# EAGLE schematic Simple_MCU_V01 (EAGLE 7.5.0)

## Sheet 1 of 2
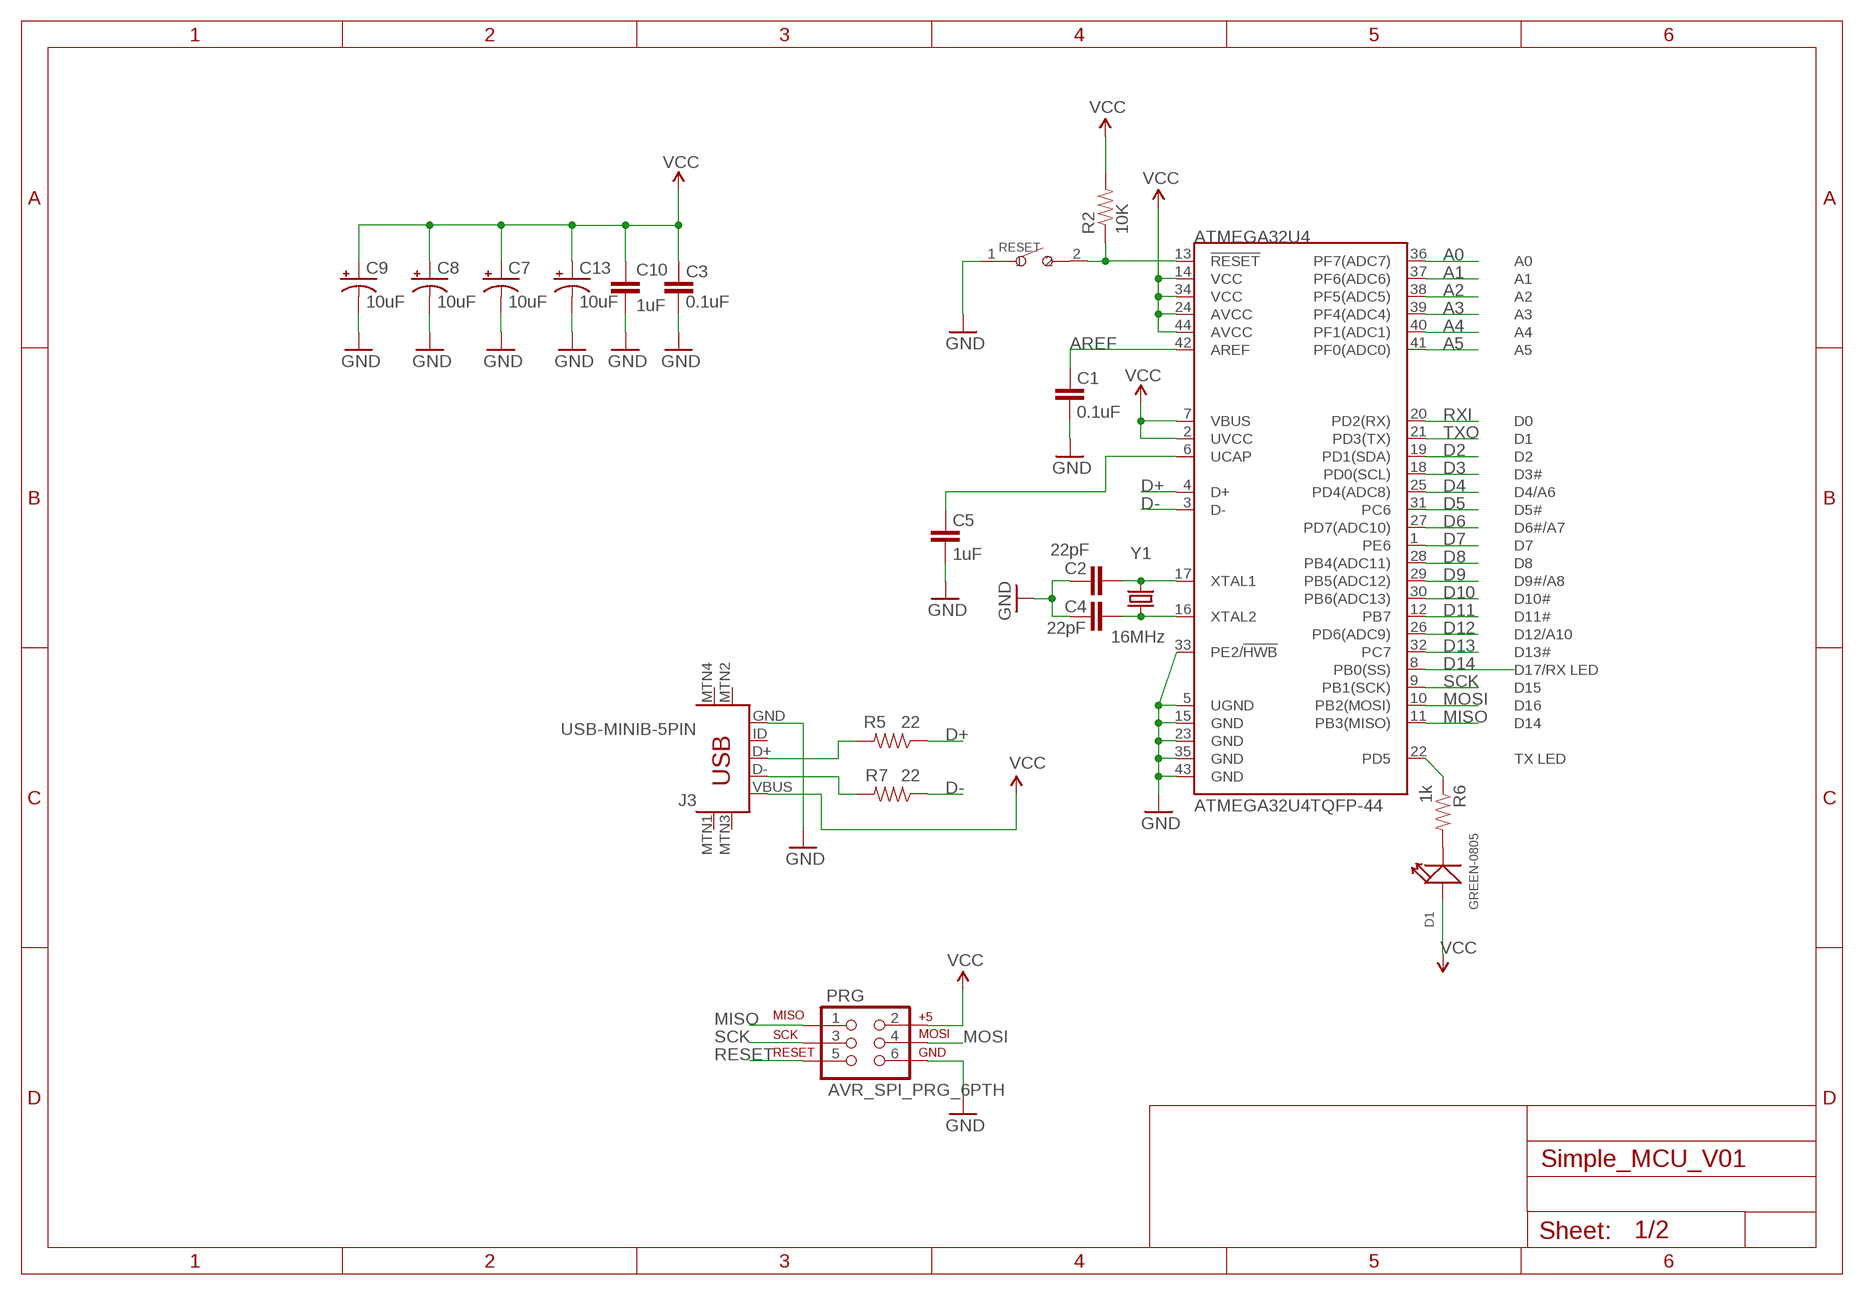
[diagram p0: schematic, sheet 1]

### Parts
ATMEGA32U4  ATMEGA32U4TQFP-44  [TQFP44]
C1  0.1uF  CAP0805  [0805]
C2  22pF  CAP0805  [0805]
C3  0.1uF  CAP0805  [0805]
C4  22pF  CAP0805  [0805]
C5  1uF  CAP0805  [0805]
C7  10uF  CAP_POL1206  [EIA3216]
C8  10uF  CAP_POL1206  [EIA3216]
C9  10uF  CAP_POL1206  [EIA3216]
C10  1uF  CAP0805  [0805]
C13  10uF  CAP_POL1206  [EIA3216]
D1  GREEN-0805  SMD-LED-CLEAR-GREEN(0805)  [LED-0805]
J3  USB-MINIB-5PIN  [USB-MINIB]
PRG  AVR_SPI_PRG_6PTH  [2X3]
R2  10K  RESISTOR0805-RES  [0805]
R5  22  RESISTOR0805-RES  [0805]
R6  1k  RESISTOR0805-RES  [0805]
R7  22  RESISTOR0805-RES  [0805]
RESET  B3U-1000P-2P-SMD  SMD-BUTTON(2P-4.0X3.0X1.5+0.5MM)SW-TS-017A-2P  [SW2-4.0X3.0X2.0]
Y1  16MHz  CRYSTALHC49US  [HC49US]

### Nets
3.3V [vcc]: ATMEGA32U4.2(UVCC) ATMEGA32U4.7(VBUS) ATMEGA32U4.14(VCC) ATMEGA32U4.24(AVCC) ATMEGA32U4.34(VCC) ATMEGA32U4.44(AVCC) C3.2 C7.A(+) C8.A(+) C9.A(+) C10.1 C13.A(+) D1.+ J3.VBUS PRG.2 R2.2 ; supply symbol labelled VCC ; also sheet 2
A0: ATMEGA32U4.36(PF7(ADC7))
A1: ATMEGA32U4.37(PF6(ADC6))
A2: ATMEGA32U4.38(PF5(ADC5))
A3: ATMEGA32U4.39(PF4(ADC4))
A4: ATMEGA32U4.40(PF1(ADC1))
A5: ATMEGA32U4.41(PF0(ADC0))
AREF: ATMEGA32U4.42(AREF) C1.2
D2: ATMEGA32U4.19(PD1(SDA))
D3: ATMEGA32U4.18(PD0(SCL))
D4: ATMEGA32U4.25(PD4(ADC8))
D5: ATMEGA32U4.31(PC6) ; also sheet 2
D6: ATMEGA32U4.27(PD7(ADC10))
D7: ATMEGA32U4.1(PE6)
D8: ATMEGA32U4.28(PB4(ADC11))
D9: ATMEGA32U4.29(PB5(ADC12))
D10: ATMEGA32U4.30(PB6(ADC13))
D11: ATMEGA32U4.12(PB7)
D12: ATMEGA32U4.26(PD6(ADC9))
D13: ATMEGA32U4.32(PC7)
D14: ATMEGA32U4.8(PB0(SS))
D+: ATMEGA32U4.4(D+) R5.1
D-: ATMEGA32U4.3(D-) R7.1
GND: ATMEGA32U4.5(UGND) ATMEGA32U4.15(GND) ATMEGA32U4.23(GND) ATMEGA32U4.33(PE2/!HWB) ATMEGA32U4.35(GND) ATMEGA32U4.43(GND) C1.1 C2.2 C3.1 C4.2 C5.1 C7.C(-) C8.C(-) C9.C(-) C10.2 C13.C(-) J3.GND PRG.6 RESET.1 ; also sheet 2
MISO: ATMEGA32U4.11(PB3(MISO)) PRG.1
MOSI: ATMEGA32U4.10(PB2(MOSI)) PRG.4
N$1: ATMEGA32U4.16(XTAL2) C4.1 Y1.1
N$2: ATMEGA32U4.17(XTAL1) C2.1 Y1.2
N$4: ATMEGA32U4.6(UCAP) C5.2
N$6: J3.D- R7.2
N$7: D1.- R6.2
N$8: J3.D+ R5.2
RESET: ATMEGA32U4.13(!RESET) PRG.5 R2.1 RESET.2
RXI: ATMEGA32U4.20(PD2(RX))
SCK: ATMEGA32U4.9(PB1(SCK)) PRG.3
TXLED: ATMEGA32U4.22(PD5) R6.1
TXO: ATMEGA32U4.21(PD3(TX))
Unconnected: J3.ID J3.MTN1(MTN2) J3.MTN2(MTN3) J3.MTN3(MTN1) J3.MTN4

## Sheet 2 of 2
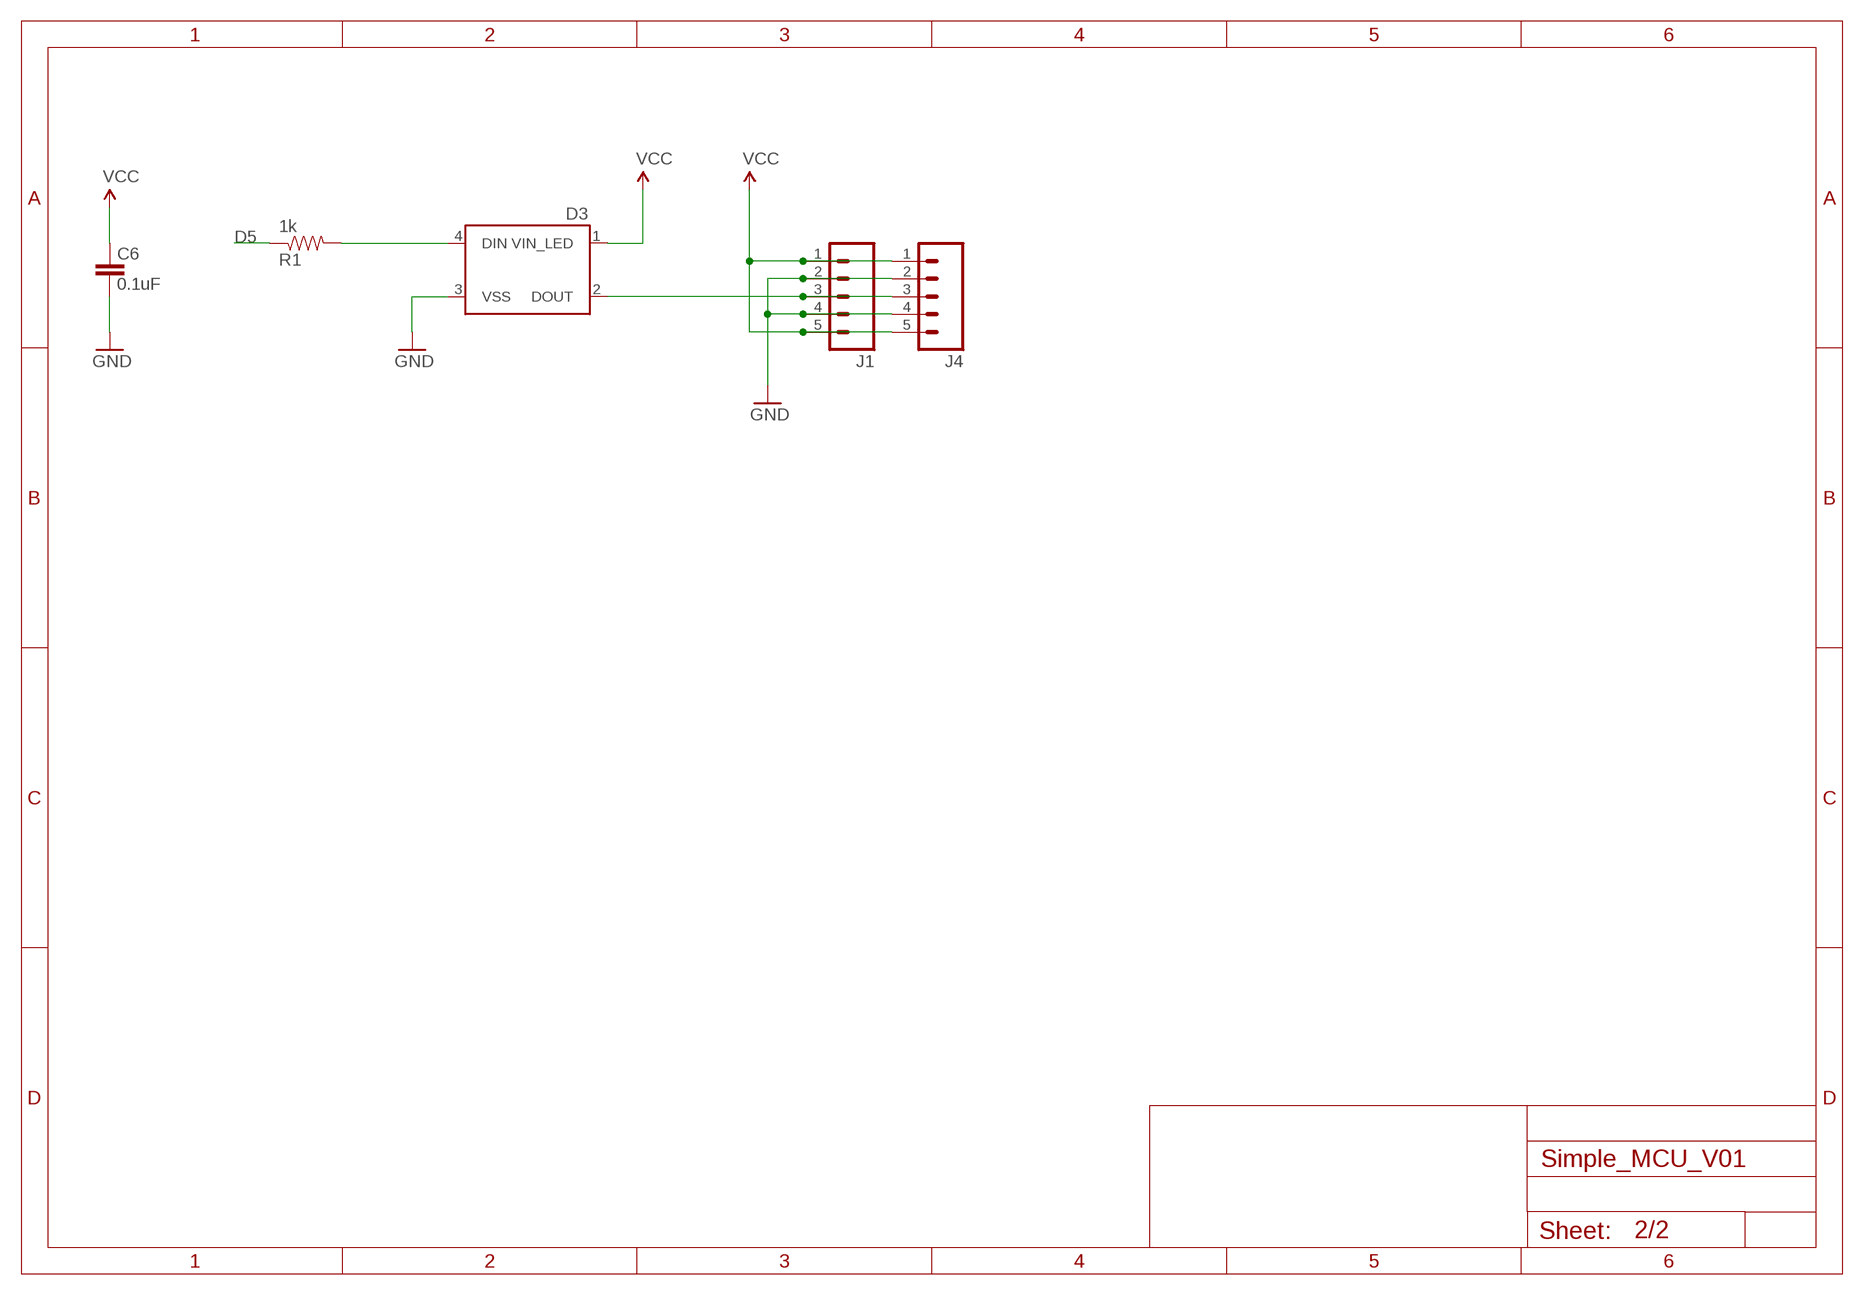
[diagram p1: schematic, sheet 2]

### Parts
C6  0.1uF  CAP0805  [0805]
D3  WS2812B  [WS2812B]
J1  M05NO_SILK  [1X05_NO_SILK]
J4  M05PTH_LONGPADS  [1X05_LONGPADS]
R1  1k  RESISTOR0805-RES  [0805]

### Nets
3.3V [vcc]: C6.2 D3.1(VIN_LED) J1.1 J1.5 J4.1 J4.5 ; supply symbol labelled VCC ; also sheet 1
D5: R1.1 ; also sheet 1
GND: C6.1 D3.3(VSS) J1.2 J1.4 J4.2 J4.4 ; also sheet 1
N$3: D3.4(DIN) R1.2
N$5: D3.2(DOUT) J1.3 J4.3

## Library data of the parts
ATMEGA32U4 = SparkFun-DigitalIC:ATMEGA32U4: Atmel 44-pin 8-bit Microcontroller with 32KBytes of ISP Flash and USB Controller
C1-C6 C10 = SparkFun:CAP: Capacitor Standard 0603 ceramic capacitor, and 0.1" leaded capacitor.
C7-C9 C13 = SparkFun:CAP_POL: Capacitor Polarized These are standard SMD and PTH capacitors. Normally 10uF, 47uF, and 100uF in electrolytic and tantalum varieties. Always verify the external diameter of the through hole cap, it varies with capacity, voltage, and manufacturer. The EIA devices should be standard.
D1 = Seeed-LED-2016:SMD-LED-CLEAR-GREEN(0805): 304090057; MPN: 17-215SYGC/S530-E2/TR8
D3 = SparkFun-LED:WS2812B: WS2812B - Intelligent control LED integrated light source Technical Specifications: Power Supply Voltage (VDD): 3.5 to 5.3 V Input Voltage (VI): -0.5 to VDD+0.5 V Operating Junction Temperature (Topt): -25°C to +80°C Storage Temperature Range (Tstg): -55°C to +150°C; PROD_ID: DIO-12503
J1 J4 = SparkFun-Connectors:M05: Header 5 Standard 5-pin 0.1" header. Use with straight break away headers (SKU : PRT-00116), right angle break away headers (PRT-00553), swiss pins (PRT-00743), machine pins (PRT-00117), and female headers (PRT-00115). Molex polarized connector foot print use with SKU : PRT-08230 with associated crimp pins and housings.
J3 = SparkFun-Connectors:USB-MINIB: Mini-USB "B" connector with 5th pin broken out. Created new symbol breaking out 5th "ID" pin in mini/micro USB connector spec. See: http://en.wikipedia.org/wiki/Mini_usb#Cables. Uses same footprint as 4-pin symbol. Also added pins to connect to mounting / shield pads if required (probably not generally needed as signals aren't shielded once they leave the connector).; PROD_ID: CONN-08193
PRG = SparkFun-Connectors:AVR_SPI_PRG_6: AVR ISP 6 Pin This is the reduced ISP connector for AVR programming. Common on Arduino. This footprint will take up less PCB space and can be used with a 10-pin to 6-pin adapter such as SKU: BOB-08508 **Special note about "TEST_POINT" package. The stop mask is on the top side, so if you want your programming test points to be on the bottom of your board, make sure to place this package on the bottom side of the board. This also ensure that the orientation to program from the bottom side will be correct.
R1 R2 R5-R7 = SparkFun:RESISTOR: Resistor Basic schematic elements and footprints for 0603, 1206, and PTH resistors.
RESET = SMD_Button_Custom:SMD-BUTTON(2P-4.0X3.0X1.5+0.5MM): 311020047; MPN: B3U-1000P-2P-SMD
Y1 = SparkFun:CRYSTAL: Crystals Various standard crystals. Proven footprints. Spark Fun Electronics SKU : COM-00534

## Net classes
0 default: width 0.203 mm